# Altium schematic sheet Top.SchDoc
size A4
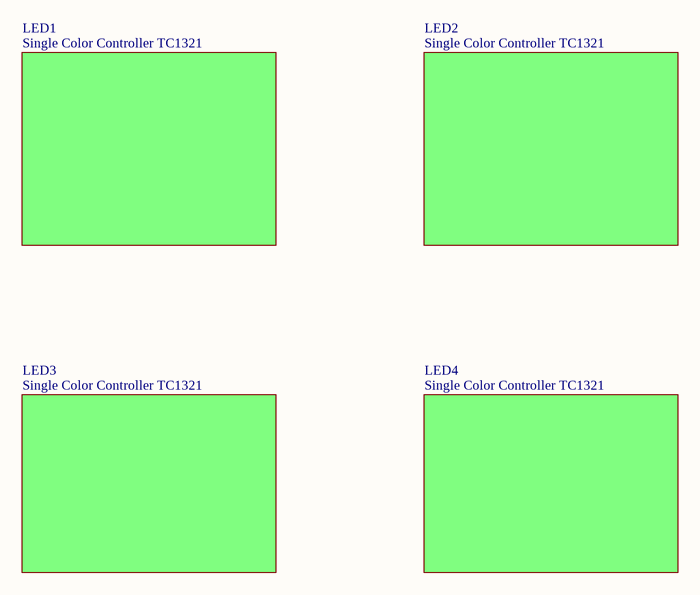
[diagram p0: Top.SchDoc]

## Sub-sheets
LED1 = Single Color Controller TC1321: no entries
LED2 = Single Color Controller TC1321: no entries
LED3 = Single Color Controller TC1321: no entries
LED4 = Single Color Controller TC1321: no entries